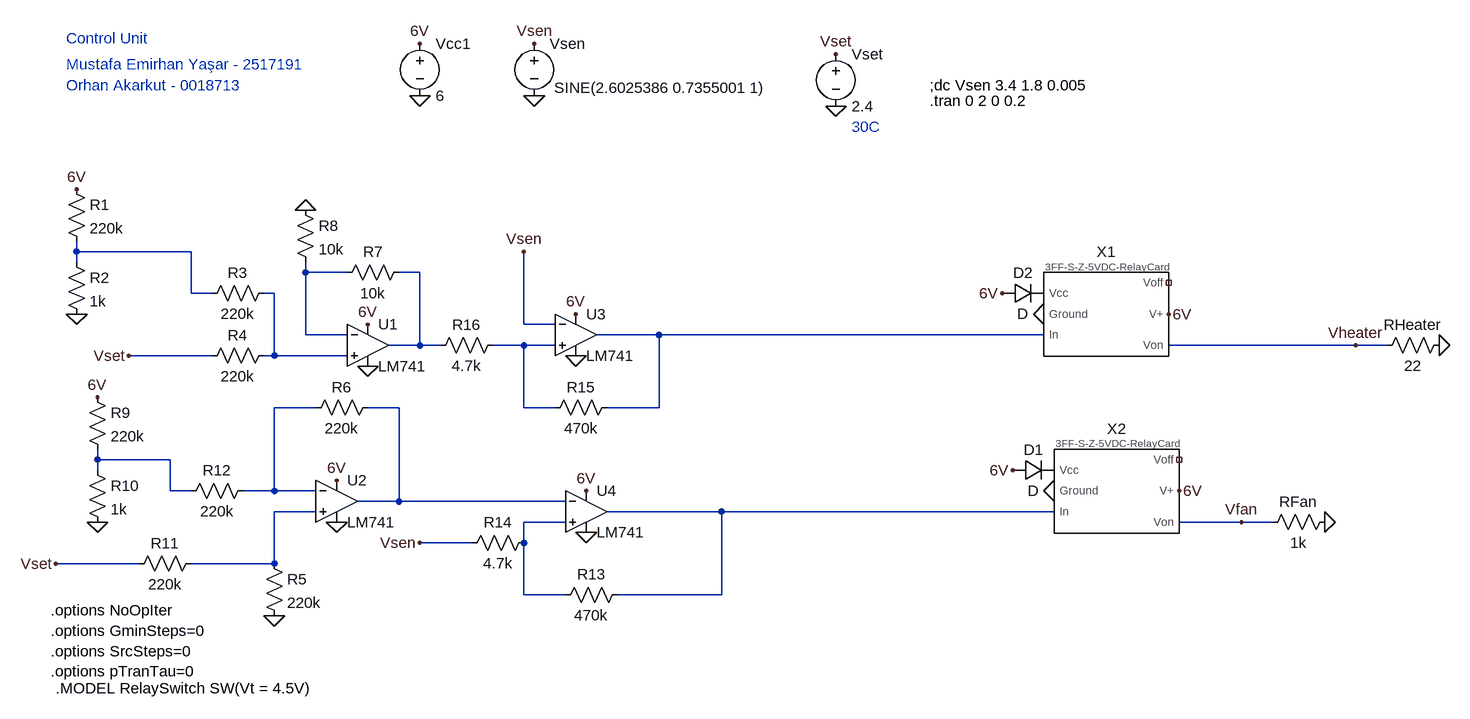
[diagram p0: schematic Unit_Control.asc]
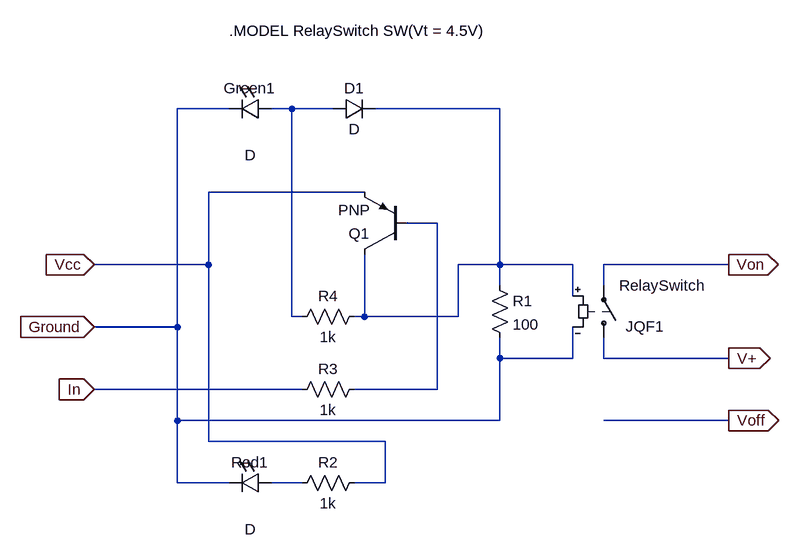
[diagram p1: sub-circuit 3ff-s-z-5vdc-relaycard.asc]
Unit_Control.asc, the LTspice schematic file:
Version 4
SHEET 1 4052 968
WIRE 128 0 128 -16
WIRE 304 0 128 0
WIRE 128 16 128 0
WIRE 480 32 480 16
WIRE 544 32 480 32
WIRE 656 32 624 32
WIRE 304 64 304 0
WIRE 336 64 304 64
WIRE 432 64 416 64
WIRE 816 112 816 0
WIRE 864 112 816 112
WIRE 480 128 480 32
WIRE 544 128 480 128
WIRE 1024 128 928 128
WIRE 1616 128 1024 128
WIRE 656 144 656 32
WIRE 656 144 608 144
WIRE 688 144 656 144
WIRE 816 144 768 144
WIRE 864 144 816 144
WIRE 2096 144 1808 144
WIRE 2144 144 2096 144
WIRE 336 160 208 160
WIRE 432 160 432 64
WIRE 432 160 416 160
WIRE 544 160 432 160
WIRE 496 240 432 240
WIRE 624 240 576 240
WIRE 816 240 816 144
WIRE 864 240 816 240
WIRE 1024 240 1024 128
WIRE 1024 240 944 240
WIRE 160 320 160 304
WIRE 272 320 160 320
WIRE 160 336 160 320
WIRE 272 368 272 320
WIRE 304 368 272 368
WIRE 432 368 432 240
WIRE 432 368 384 368
WIRE 496 368 432 368
WIRE 624 384 624 240
WIRE 624 384 560 384
WIRE 880 384 624 384
WIRE 496 400 432 400
WIRE 1120 400 944 400
WIRE 1632 400 1120 400
WIRE 880 416 816 416
WIRE 1920 416 1824 416
WIRE 1968 416 1920 416
WIRE 736 448 656 448
WIRE 816 448 816 416
WIRE 224 480 96 480
WIRE 432 480 432 400
WIRE 432 480 304 480
WIRE 816 528 816 448
WIRE 880 528 816 528
WIRE 1120 528 1120 400
WIRE 1120 528 960 528
FLAG 208 160 Vset
FLAG 816 0 Vsen
FLAG 656 -240 0
FLAG 656 -320 6V
FLAG 896 96 6V
FLAG 912 368 6V
FLAG 912 432 0
FLAG 2224 144 0
FLAG 2048 416 0
FLAG 1632 368 0
FLAG 1568 336 6V
FLAG 1824 368 6V
FLAG 1920 416 Vfan
FLAG 2096 144 Vheater
FLAG 1552 64 6V
FLAG 896 160 0
FLAG 1616 96 0
FLAG 1808 96 6V
FLAG 832 -240 0
FLAG 1296 -224 0
FLAG 832 -320 Vsen
FLAG 1296 -304 Vset
FLAG 128 96 0
FLAG 128 -96 6V
FLAG 576 112 6V
FLAG 576 176 0
FLAG 480 -64 0
FLAG 96 480 Vset
FLAG 656 448 Vsen
FLAG 160 416 0
FLAG 160 224 6V
FLAG 528 352 6V
FLAG 528 416 0
FLAG 432 560 0
SYMBOL voltage 656 -336 R0
WINDOW 123 0 0 Left 0
WINDOW 39 0 0 Left 0
SYMATTR InstName Vcc1
SYMATTR Value 6
SYMBOL res 2240 128 R90
WINDOW 0 0 56 VBottom 2
WINDOW 3 32 56 VTop 2
SYMATTR InstName RHeater
SYMATTR Value 22
SYMBOL res 2064 400 R90
WINDOW 0 0 56 VBottom 2
WINDOW 3 32 56 VTop 2
SYMATTR InstName RFan
SYMATTR Value 1k
SYMBOL Switches\\3FF-S-Z-5VDC-RelayCard 1712 96 R0
SYMATTR InstName X1
SYMBOL Switches\\3FF-S-Z-5VDC-RelayCard 1728 368 R0
SYMATTR InstName X2
SYMBOL diode 1552 80 R270
WINDOW 0 32 32 VTop 2
WINDOW 3 0 32 VBottom 2
SYMATTR InstName D2
SYMBOL diode 1568 352 R270
WINDOW 0 32 32 VTop 2
WINDOW 3 0 32 VBottom 2
SYMATTR InstName D1
SYMBOL voltage 832 -336 R0
WINDOW 123 0 0 Left 0
WINDOW 39 0 0 Left 0
WINDOW 3 31 84 Left 2
SYMATTR Value SINE(2.6025386 0.7355001 1)
SYMATTR InstName Vsen
SYMBOL voltage 1296 -320 R0
WINDOW 123 0 0 Left 0
WINDOW 39 0 0 Left 0
SYMATTR InstName Vset
SYMATTR Value 2.4
SYMBOL res 112 -112 R0
SYMATTR InstName R1
SYMATTR Value 220k
SYMBOL res 112 0 R0
SYMATTR InstName R2
SYMATTR Value 1k
SYMBOL res 432 144 R90
WINDOW 0 0 56 VBottom 2
WINDOW 3 32 56 VTop 2
SYMATTR InstName R4
SYMATTR Value 220k
SYMBOL res 432 48 R90
WINDOW 0 0 56 VBottom 2
WINDOW 3 32 56 VTop 2
SYMATTR InstName R3
SYMATTR Value 220k
SYMBOL res 640 16 R90
WINDOW 0 0 56 VBottom 2
WINDOW 3 32 56 VTop 2
SYMATTR InstName R7
SYMATTR Value 10k
SYMBOL res 464 -80 R0
SYMATTR InstName R8
SYMATTR Value 10k
SYMBOL res 144 208 R0
SYMATTR InstName R9
SYMATTR Value 220k
SYMBOL res 144 320 R0
SYMATTR InstName R10
SYMATTR Value 1k
SYMBOL res 320 464 R90
WINDOW 0 0 56 VBottom 2
WINDOW 3 32 56 VTop 2
SYMATTR InstName R11
SYMATTR Value 220k
SYMBOL res 416 464 R0
SYMATTR InstName R5
SYMATTR Value 220k
SYMBOL res 592 224 R90
WINDOW 0 0 56 VBottom 2
WINDOW 3 32 56 VTop 2
SYMATTR InstName R6
SYMATTR Value 220k
SYMBOL res 400 352 R90
WINDOW 0 0 56 VBottom 2
WINDOW 3 32 56 VTop 2
SYMATTR InstName R12
SYMATTR Value 220k
SYMBOL res 976 512 R90
WINDOW 0 0 56 VBottom 2
WINDOW 3 32 56 VTop 2
SYMATTR InstName R13
SYMATTR Value 470k
SYMBOL res 832 432 R90
WINDOW 0 0 56 VBottom 2
WINDOW 3 32 56 VTop 2
SYMATTR InstName R14
SYMATTR Value 4.7k
SYMBOL res 960 224 R90
WINDOW 0 0 56 VBottom 2
WINDOW 3 32 56 VTop 2
SYMATTR InstName R15
SYMATTR Value 470k
SYMBOL res 784 128 R90
WINDOW 0 0 56 VBottom 2
WINDOW 3 32 56 VTop 2
SYMATTR InstName R16
SYMATTR Value 4.7k
SYMBOL OpAmps\\LM741 576 80 R0
SYMATTR InstName U1
SYMBOL OpAmps\\LM741 528 320 R0
SYMATTR InstName U2
SYMBOL OpAmps\\LM741 896 64 R0
SYMATTR InstName U3
SYMBOL OpAmps\\LM741 912 336 R0
SYMATTR InstName U4
TEXT 112 -328 Left 2 ;Control Unit
TEXT 112 -288 Left 2 ;Mustafa Emirhan Yaşar - 2517191
TEXT 112 -256 Left 2 ;Orhan Akarkut - 0018713
TEXT 88 552 Left 2 !.options NoOpIter\n.options GminSteps=0\n.options SrcSteps=0\n.options pTranTau=0
TEXT 96 672 Left 2 !.MODEL RelaySwitch SW(Vt = 4.5V)
TEXT 1440 -232 Left 2 !.tran 0 2 0 0.2
TEXT 1320 -192 Left 2 ;30C
TEXT 1440 -256 Left 2 !;dc Vsen 3.4 1.8 0.005

3ff-s-z-5vdc-relaycard.asc, the sub-circuit schematic file:
Version 4
SHEET 1 916 680
WIRE 16 -128 -64 -128
WIRE 112 -128 80 -128
WIRE 176 -128 112 -128
WIRE 432 -128 240 -128
WIRE 224 0 -16 0
WIRE 336 48 288 48
WIRE -16 112 -16 0
WIRE -16 112 -192 112
WIRE 432 112 432 -128
WIRE 432 112 368 112
WIRE 544 112 432 112
WIRE 784 112 592 112
WIRE 432 144 432 112
WIRE 592 144 592 112
WIRE 544 160 544 112
WIRE 112 192 112 -128
WIRE 128 192 112 192
WIRE 224 192 224 96
WIRE 224 192 208 192
WIRE 368 192 368 112
WIRE 368 192 224 192
WIRE -64 208 -64 -128
WIRE -64 208 -192 208
WIRE 432 256 432 224
WIRE 544 256 544 208
WIRE 544 256 432 256
WIRE 592 256 592 224
WIRE 784 256 592 256
WIRE 128 304 -192 304
WIRE 336 304 336 48
WIRE 336 304 208 304
WIRE -64 352 -64 208
WIRE 432 352 432 256
WIRE 432 352 -64 352
WIRE 784 352 592 352
WIRE -16 384 -16 112
WIRE 256 384 -16 384
WIRE -64 448 -64 352
WIRE 16 448 -64 448
WIRE 128 448 80 448
WIRE 256 448 256 384
WIRE 256 448 208 448
FLAG -192 304 In
IOPIN -192 304 In
FLAG -192 208 Ground
IOPIN -192 208 In
FLAG -192 112 Vcc
IOPIN -192 112 In
FLAG 784 256 V+
IOPIN 784 256 Out
FLAG 784 112 Von
IOPIN 784 112 Out
FLAG 784 352 Voff
IOPIN 784 352 Out
SYMBOL sw 592 240 M180
WINDOW 0 34 33 Left 2
SYMATTR InstName JQF1
SYMATTR Value RelaySwitch
SYMBOL res 416 128 R0
SYMATTR InstName R1
SYMATTR Value 100
SYMBOL LED 80 -144 R90
WINDOW 0 0 32 VBottom 2
WINDOW 3 72 32 VTop 2
SYMATTR InstName Green1
SYMBOL diode 176 -112 R270
WINDOW 0 32 32 VTop 2
WINDOW 3 0 32 VBottom 2
SYMATTR InstName D1
SYMBOL LED 80 432 R90
WINDOW 0 0 32 VBottom 2
WINDOW 3 72 32 VTop 2
SYMATTR InstName Red1
SYMBOL res 112 464 R270
WINDOW 0 32 56 VTop 2
WINDOW 3 0 56 VBottom 2
SYMATTR InstName R2
SYMATTR Value 1k
SYMBOL res 112 320 R270
WINDOW 0 32 56 VTop 2
WINDOW 3 0 56 VBottom 2
SYMATTR InstName R3
SYMATTR Value 1k
SYMBOL pnp 288 96 R180
SYMATTR InstName Q1
SYMBOL res 112 208 R270
WINDOW 0 32 56 VTop 2
WINDOW 3 0 56 VBottom 2
SYMATTR InstName R4
SYMATTR Value 1k
TEXT 16 -248 Left 2 !.MODEL RelaySwitch SW(Vt = 4.5V)

The netlist it stands for:
* Unit_Control.asc
Vcc1 6V 0 6
RHeater 0 Vheater 22
RFan 0 Vfan 1k
XX1 0 N005 P001 6V NC_01 Vheater 3ff-s-z-5vdc-relaycard
XX2 0 N011 P002 6V NC_02 Vfan 3ff-s-z-5vdc-relaycard
D2 6V P001 D
D1 6V P002 D
Vsen Vsen 0 SINE(2.6025386 0.7355001 1)
Vset Vset 0 2.4
R1 6V N001 220k
R2 N001 0 1k
R4 N004 Vset 220k
R3 N004 N001 220k
R7 N003 N002 10k
R8 0 N002 10k
R9 6V N009 220k
R10 N009 0 1k
R11 N010 Vset 220k
R5 N010 0 220k
R6 N008 N007 220k
R12 N007 N009 220k
R13 N011 N012 470k
R14 N012 Vsen 4.7k
R15 N005 N006 470k
R16 N006 N003 4.7k
XU1 N004 N002 6V 0 N003 LM741  ; pins In+ In- V+ V- OUT
XU2 N010 N007 6V 0 N008 LM741  ; pins In+ In- V+ V- OUT
XU3 N006 Vsen 6V 0 N005 LM741  ; pins In+ In- V+ V- OUT
XU4 N012 N008 6V 0 N011 LM741  ; pins In+ In- V+ V- OUT

* block symbol definitions
.subckt 3ff-s-z-5vdc-relaycard Ground In Vcc V+ Voff Von
S§JQF1 V+ Von N002 Ground RelaySwitch
R1 N002 Ground 100
D§Green1 N001 Ground D
D1 N001 N002 D
D§Red1 N004 Ground D
R2 N004 Vcc 1k
R3 In N003 1k
Q1 N002 N003 Vcc 0 PNP
R4 N001 N002 1k
.MODEL RelaySwitch SW(Vt = 4.5V)
.ends 3ff-s-z-5vdc-relaycard

.model D D
.lib standard.dio
.model NPN NPN
.model PNP PNP
.lib standard.bjt
* Control Unit
* Mustafa Emirhan Yaşar - 2517191
* Orhan Akarkut - 0018713
.options NoOpIter
.options GminSteps=0
.options SrcSteps=0
.options pTranTau=0
.MODEL RelaySwitch SW(Vt = 4.5V)
.tran 0 2 0 0.2
* 30C
;dc Vsen 3.4 1.8 0.005
.lib LM741.lib
.backanno
.end